# Altium schematic sheet main.SchDoc
size A4; SheetNumber: 1; SheetTotal: 3
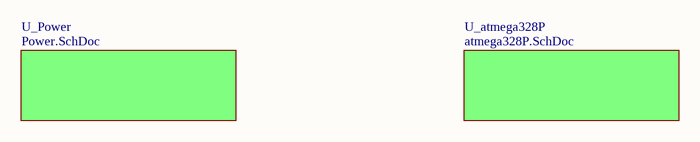
[diagram p0: main.SchDoc]

## Sub-sheets
U_atmega328P = atmega328P.SchDoc: no entries
U_Power = Power.SchDoc: no entries